# Altium schematic sheet 12.4呼叫器.SchDoc
size A3
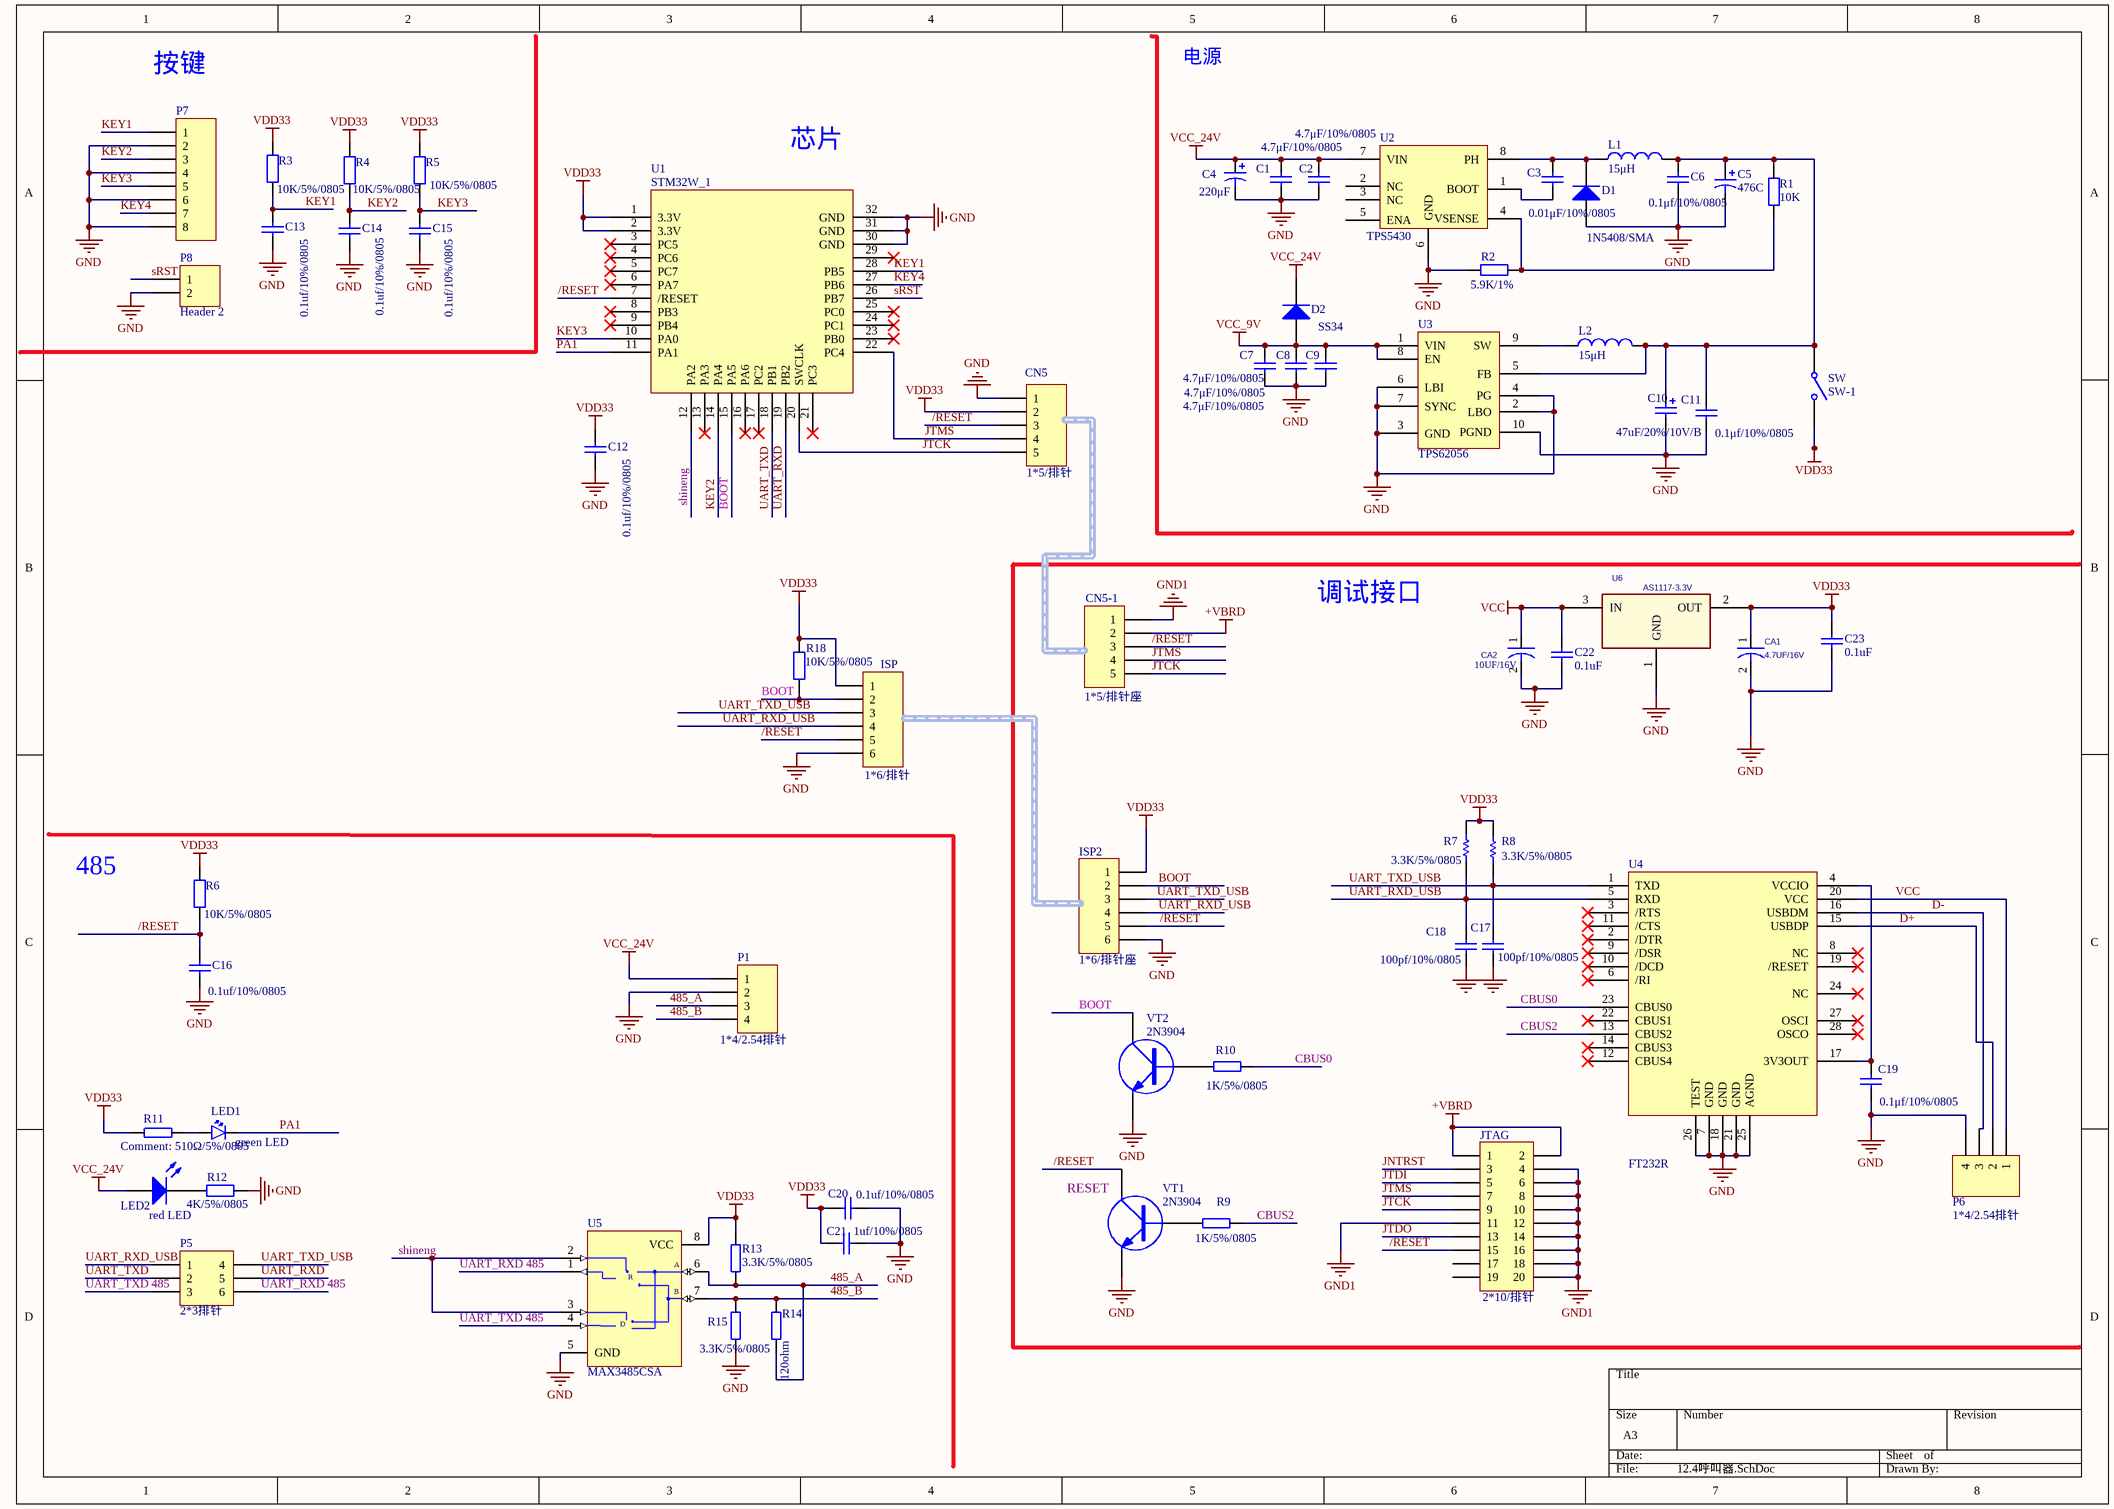
[diagram p0: 12.4呼叫器.SchDoc]

## Parts
C1  4.7μF/10%/0805  [C-0805]
C2  4.7μF/10%/0805  [C-0805]
C3  0.01μF/10%/0805  [C-0805]
C4  220μF  [CZ3.0/6.5]
C5  476C  [C-TAN-D]
C6  0.1μf/10%/0805  [C-0805]
C7  4.7μF/10%/0805  [C-0805]
C8  4.7μF/10%/0805  [C-0805]
C9  4.7μF/10%/0805  [C-0805]
C10  47uF/20%/10V/B  [C-TAN-B]
C11  0.1μf/10%/0805  [C-0805]
C12  0.1uf/10%/0805  [C-0805]
C13  0.1uf/10%/0805  [C-0805]
C14  0.1uf/10%/0805  [C-0805]
C15  0.1uf/10%/0805  [C-0805]
C16  0.1uf/10%/0805  [C-0805]
C17  100pf/10%/0805  [C-0805]
C18  100pf/10%/0805  [C-0805]
C19  0.1μf/10%/0805  [C-0805]
C20  0.1uf/10%/0805  [C-0805]
C21  1uf/10%/0805  [C-0805]
C22  0.1uF  [C0805]
C23  0.1uF  [C0805]
CA1  4.7UF/16V  [3528]
CA2  10UF/16V  [3528]
CN5  1*5/排针  [PIN-S-2.54-1*5]
CN5-1  1*5/排针座  [PIN-S-2.54-1*5]
D1  1N5408/SMA  [SMA 2+]
D2  SS34  [smb]
ISP  1*6/排针  [PIN-S-2.54-1*6]
ISP2  1*6/排针座  [PIN-S-2.54-1*6]
JTAG  2*10/排针  [IDC-20]
L1  15μH  [GSDS104C2]
L2  15μH  [GSDS104C2]
LED1  green LED  [LED-φ3]
LED2  red LED  [LED-φ3]
P1  1*4/2.54排针  [PIN-S-2.54-1*4]
P5  2*3排针  [HDR2X3_CEN]
P6  1*4/2.54排针  [USB_B_90D]
P7  Header 8  [HDR1X8]  (value not drawn)
P8  Header 2  [HDR1X2]
R1  10K  [R-0805]
R2  5.9K/1%  [R-0805]
R3  10K/5%/0805  [R-0805]
R4  10K/5%/0805  [R-0805]
R5  10K/5%/0805  [R-0805]
R6  10K/5%/0805  [R-0805]
R7  3.3K/5%/0805  [R-0805]
R8  3.3K/5%/0805  [R-0805]
R9  1K/5%/0805  [R-0805]
R10  1K/5%/0805  [R-0805]
R11  510Ω/5%/0805  [R-0805]
R12  4K/5%/0805  [R-0805]
R13  3.3K/5%/0805  [R-0805]
R14  120ohm  [R-0805]
R15  3.3K/5%/0805  [R-0805]
R18  10K/5%/0805  [R-0805]
SW  SW-1  [PIN-S-2.54-1*2]
U1  STM32W_1  [STM32W108-3]
U2  TPS5430  [SO-G8]
U3  TPS62056  [MSOP-10]
U4  FT232R  [SSOP-28]
U5  MAX3485CSA  [SO-G8]
U6  AS1117-3.3V  [SOT-223]
VT1  2N3904  [SOT23-3]
VT2  2N3904  [SOT23-3]

## Nets
+VBRD: CN5-1.2 JTAG.1 JTAG.2
GND: C1.1 C2.1 C4.2 C5.2 C6.1 C7.1 C8.1 C9.1 C10.2 C11.1 C12.1 C13.1 C14.1 C15.1 C16.1 C17.1 C18.1 C19.1 C20.1 C21.1 C22.1 C23.1 CA1.2 CA2.2 CN5.1 D1.1(A) ISP.6 ISP2.6 P1.2 P6.4 P7.2 P7.4 P7.6 P7.8 P8.2 R2.2 R12.1 R15.1 U1.30(GND) U1.31(GND) U1.32(GND) U2.6(GND) U3.2(LBO) U3.3(GND) U3.4(PG) U3.6(LBI) U3.7(SYNC) U3.10(PGND) U4.7(GND) U4.18(GND) U4.21(GND) U4.25(AGND) U4.26(TEST) U5.5(GND) U6.1(GND) VT1.2(E) VT2.2(E)
GND1: CN5-1.1 JTAG.4 JTAG.6 JTAG.8 JTAG.10 JTAG.11 JTAG.12 JTAG.14 JTAG.16 JTAG.18 JTAG.20
VCC: C22.2 CA2.1 P6.1 U4.20(VCC) U6.3(IN)
VCC_9V: C7.2 C8.2 C9.2 D2.1(A) U3.1(VIN) U3.8(EN)
VCC_24V: C1.2 C2.2 C4.1 D2.2(K) LED2.1(A) P1.1 U2.7(VIN)
VDD33: C12.2 C20.2 C21.2 C23.2 CA1.1 CN5.2 ISP.1 ISP2.1 R3.2 R4.2 R5.2 R6.2 R7.2 R8.2 R11.1 R13.2 R18.2 SW.2 U1.1(3.3V) U1.2(3.3V) U5.8(VCC) U6.2(OUT)
485_A: P1.3 R13.1 R14.2 U5.6(A)
485_B: P1.4 R14.1 R15.2 U5.7(B)
/RESET: C16.2 CN5.3 CN5-1.3 ISP.5 ISP2.5 JTAG.15 R6.1 U1.7(/RESET) VT1.3(C)
BOOT: ISP.2 ISP2.2 R18.1 U1.15(PA5) VT2.3(C)
CBUS0: R10.2 U4.23(CBUS0)
CBUS2: R9.2 U4.13(CBUS2)
D+: P6.2 U4.15(USBDP)
D-: P6.3 U4.16(USBDM)
JNTRST: JTAG.3
JTCK: CN5.5 CN5-1.5 JTAG.9 U1.20(SWCLK)
JTDI: JTAG.5
JTDO: JTAG.13
JTMS: CN5.4 CN5-1.4 JTAG.7 U1.22(PC4)
KEY1: C13.2 P7.1 R3.1 U1.28(PB5)
KEY2: C14.2 P7.3 R4.1 U1.14(PA4)
KEY3: C15.2 P7.5 R5.1 U1.10(PA0)
KEY4: P7.7 U1.27(PB6)
PA1: LED1.2(K) U1.11(PA1)
shineng: U1.12(PA2) U5.2(~{RE}) U5.3(DE)
sRST: P8.1 U1.26(PB7)
UART_RXD: P5.5 U1.19(PB2)
UART_RXD 485: P5.6 U5.1(RO)
UART_RXD_USB: C18.2 ISP.4 ISP2.4 P5.1 R7.1 U4.5(RXD)
UART_TXD: P5.2 U1.18(PB1)
UART_TXD 485: P5.3 U5.4(DI)
UART_TXD_USB: C17.2 ISP.3 ISP2.3 P5.4 R8.1 U4.1(TXD)
NetC3_1: C3.1 U2.1(BOOT)
NetC3_2: C3.2 D1.2(K) L1.1 U2.8(PH)
NetC5_1: C5.1 C6.2 C10.1 C11.2 L1.2 L2.2 R1.2 SW.1 U3.5(FB)
NetC19_2: C19.2 U4.4(VCCIO) U4.17(3V3OUT)
NetL2_1: L2.1 U3.9(SW)
NetLED1_1: LED1.1(A) R11.2
NetLED2_2: LED2.2(K) R12.2
NetR1_1: R1.1 R2.1 U2.4(VSENSE)
NetR9_1: R9.1 VT1.1(B)
NetR10_1: R10.1 VT2.1(B)

Not connected (* = marked no-connect by the designer): JTAG 17 19; U1 3(PC5)* 4(PC6)* 5(PC7)* 6(PA7)* 8(PB3)* 9(PB4)* 13(PA3)* 16(PA6)* 17(PC2)* 21(PC3)* 23(PB0)* 24(PC1)* 25(PC0)* 29*; U2 2(NC) 3(NC) 5(ENA); U4 2(/DTR)* 3(/RTS)* 6(/RI)* 8(NC)* 9(/DSR)* 10(/DCD)* 11(/CTS)* 12(CBUS4)* 14(CBUS3)* 19(/RESET)* 22(CBUS1)* 24(NC)* 27(OSCI)* 28(OSCO)*

## Notes on the sheet
- (near P7) 按键
- 电源
- 芯片
- 调试接口
- 485
- (near VT1) RESET
- (in symbol MAX485CSA) R; D

## Library data of the parts
C1-C3 C6-C9 C11 C19 = Cap: Capacitor; Value: 0.01uF; Published: 8-Jun-2000; LatestRevisionDate: 17-Jul-2002; LatestRevisionNote: Re-released for DXP Platform.; PackageReference: RAD-0.3; Publisher: Altium Limited; PackageDescription: Radial Cap, Thru-Hole; 2 Leads; 0.3 in Pin Spacing
C4 = Cap Pol1: Polarized Capacitor (Radial); Value: 1uF; Published: 8-Jun-2000; LatestRevisionDate: 17-Jul-2002; LatestRevisionNote: Re-released for DXP Platform.; PackageReference: RB7.6-15; Publisher: Altium Limited; PackageDescription: Polarized Capacitor (Radial); 2 Leads
C5 = Cap Pol1: Polarized Capacitor (Radial); Value: 2.2uF; Published: 8-Jun-2000; LatestRevisionDate: 17-Jul-2002; LatestRevisionNote: Re-released for DXP Platform.; PackageReference: RB7.6-15; Publisher: Altium Limited; PackageDescription: Polarized Capacitor (Radial); 2 Leads
C10 = ASC-0013BA: 名称: 钽电容; 型号: TAJB476M010RNJ; 品牌: AVX; 规格: 47uF/20%/10V/B
C12-C18 C20-C23 = Cap: Capacitor; Value: 100pF; Published: 8-Jun-2000; LatestRevisionDate: 17-Jul-2002; LatestRevisionNote: Re-released for DXP Platform.; Publisher: Altium Limited
  C22 C23: PackageReference: RAD-0.3; PackageDescription: Radial Cap, Thru-Hole; 2 Leads; 0.3 in Pin Spacing
CA1 CA2 = ECAP
CN5 CN5-1 = Header1*5
D1 D2 = Diode 1N5408: 3 Amp Medium Power Silicon Rectifier Diode; Published: 8-Jun-2000; LatestRevisionDate: 17-Jul-2002; LatestRevisionNote: Re-released for DXP Platform.; DatasheetVersion: Aug-1984; PackageReference: DO-201AD; Publisher: Altium Limited; PackageDescription: Diode, Axial; Body 9.5 x 5.3 mm (LxDia. max), Lead Dia. 1.32 mm (max); ComponentLink1Description: Manufacturer Link; ComponentLink1URL: http://www.irf.com/
ISP ISP2 = Header1*6
JTAG = Header2*10
L1 L2 = Inductor: Code_IEC: 1005; Value: 10mH; Published: 8-Jun-2000; LatestRevisionDate: 29-May-2009; LatestRevisionNote: IPC-7351 Footprint Added.; PackageReference: 0402-A; Publisher: Altium Limited; PackageDescription: Chip Inductor; Code_JEITA: 0402
LED1 = LED
LED2 = LED3: Typical BLUE SiC LED; Published: 8-Jun-2000; LatestRevisionDate: 17-Dec-2003; LatestRevisionNote: PCB Footprint replaced.; Publisher: Altium Limited
P1 P6 = Header 4: Header, 4-Pin; LatestRevisionDate: 17-Jul-2002; LatestRevisionNote: Re-released for DXP Platform.; Publisher: Altium Limited
P5 = Header 3X2A: Header, 3-Pin, Dual row; LatestRevisionDate: 17-Jul-2002; LatestRevisionNote: Re-released for DXP Platform.; Publisher: Altium Limited
P7 = Header 8: Header, 8-Pin; LatestRevisionDate: 17-Jul-2002; LatestRevisionNote: Re-released for DXP Platform.; Publisher: Altium Limited
P8 = Header 2: Header, 2-Pin; LatestRevisionDate: 17-Jul-2002; LatestRevisionNote: Re-released for DXP Platform.; Publisher: Altium Limited
R1 = Res2: Resistor; Value: 100K; Published: 8-Jun-2000; LatestRevisionDate: 17-Jul-2002; LatestRevisionNote: Re-released for DXP Platform.; PackageReference: AXIAL-0.4; Publisher: Altium Limited; PackageDescription: Axial Device, Thru-Hole; 2 Leads; 0.4 in Pin Spacing
R2 = Res2: Resistor; Value: 1K; Published: 8-Jun-2000; LatestRevisionDate: 17-Jul-2002; LatestRevisionNote: Re-released for DXP Platform.; PackageReference: AXIAL-0.4; Publisher: Altium Limited; PackageDescription: Axial Device, Thru-Hole; 2 Leads; 0.4 in Pin Spacing
R3-R6 R12 R18 = Res2: Resistor; Value: 10K; Published: 8-Jun-2000; LatestRevisionDate: 17-Jul-2002; LatestRevisionNote: Re-released for DXP Platform.; PackageReference: AXIAL-0.4; Publisher: Altium Limited
R7 R8 = RES_1
R9-R11 R13-R15 = RES: R
U1 = STM32W108-3
U5 = MAX485CSA: Low-Power, Slew-Rate-Limited RS-485/RS-422 Transceiver; Published: 16-Jan-2001; LatestRevisionDate: 13-Apr-2006; LatestRevisionNote: IPC-7351 Footprint Added.; DatasheetVersion: Feb-1996; PackageReference: NSO8; Publisher: Altium Limited; PackageDescription: 8-Pin Small Outline Integrated Circuit 1.27 mm Pitch; Code_JEDEC: MS-012-AA; Code_IPC: SOIC127P600-8; ComponentLink1Description: Manufacturer Link; ComponentLink1URL: http://www.maxim-ic.com/; ComponentLink2Description: Datasheet; ComponentLink2URL: http://pdfserv.maxim-ic.com/en/ds/MAX1487-MAX491.pdf
U6 = AS1117
VT1 VT2 = NPN: NPN Transistor